# EAGLE design PSU Schematic (EAGLE 8.1.0)
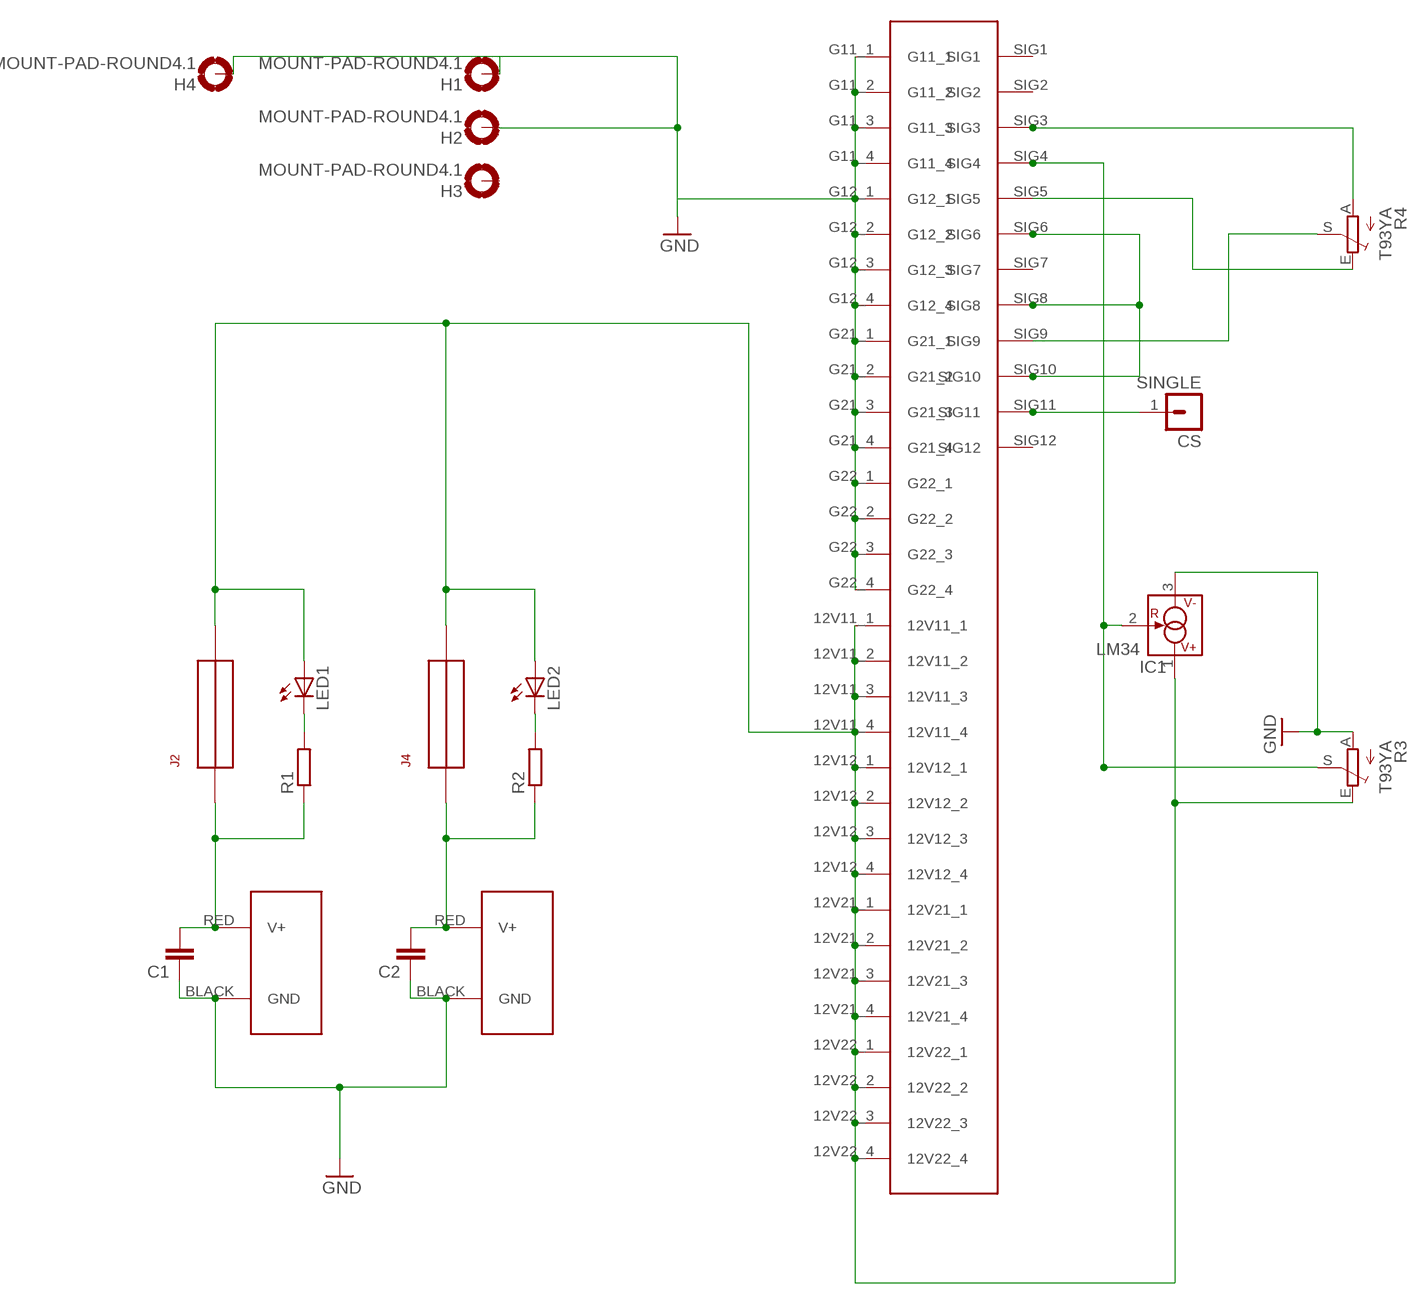
[diagram p0: schematic, sheet 1]

## Parts
C1  C-EU050-025X075  [C050-025X075]
C2  C-EU050-025X075  [C050-025X075]
CS  SINGLE  [SINGLE]
H1  MOUNT-PAD-ROUND4.1  [4,1-PAD]
H2  MOUNT-PAD-ROUND4.1  [4,1-PAD]
H3  MOUNT-PAD-ROUND4.1  [4,1-PAD]
H4  MOUNT-PAD-ROUND4.1  [4,1-PAD]
IC1  LM34  LM334Z  [TO92]
J1  POWERPOLE_POWER45A  [POWERPOLE_PAIR_45A]
J2  FUSEATC  [FUSE_ATC]
J3  POWERPOLE_POWER45A  [POWERPOLE_PAIR_45A]
J4  FUSEATC  [FUSE_ATC]
LED1  LED3MM  [LED3MM]
LED2  LED3MM  [LED3MM]
R1  R-EU_0204/7  [0204/7]
R2  R-EU_0204/7  [0204/7]
R3  T93YA  TRIM_EU-RJ9W  [RJ9W]
R4  T93YA  TRIM_EU-RJ9W  [RJ9W]
U$2  51760-10201202AALF51760-10201202AALF  [51730-073LF]

## Nets
5VCC: R4.A U$2.SIG3
CURRENTSHARE: CS.1 U$2.SIG11
FAN: IC1.2(R) R3.S U$2.SIG4
GND: C1.1 C2.1 H1.B4,1(MOUNT) H2.B4,1(MOUNT) H4.B4,1(MOUNT) IC1.3(V-) J1.BLACK(GND) J3.BLACK(GND) R3.A U$2.G11_1 U$2.G11_2 U$2.G11_3 U$2.G11_4 U$2.G12_1 U$2.G12_2 U$2.G12_3 U$2.G12_4 U$2.G21_1 U$2.G21_2 U$2.G21_3 U$2.G21_4 U$2.G22_1 U$2.G22_2 U$2.G22_3 U$2.G22_4
LVCC: IC1.1(V+) J2.P$3 J2.P$4 J4.P$3 J4.P$4 LED1.A LED2.A R3.E U$2.12V11_1 U$2.12V11_2 U$2.12V11_3 U$2.12V11_4 U$2.12V12_1 U$2.12V12_2 U$2.12V12_3 U$2.12V12_4 U$2.12V21_1 U$2.12V21_2 U$2.12V21_3 U$2.12V21_4 U$2.12V22_1 U$2.12V22_2 U$2.12V22_3 U$2.12V22_4
N$1: R4.E U$2.SIG5
N$2: R4.S U$2.SIG9
N$4: LED1.K(C) R1.2
N$5: LED2.K(C) R2.2
PPV1: C1.2 J1.RED(V+) J2.P$1 J2.P$2 R1.1
PPV2: C2.2 J3.RED(V+) J4.P$1 J4.P$2 R2.1
PSON: U$2.SIG6 U$2.SIG8 U$2.SIG10
Unconnected: H3.B4,1(MOUNT) U$2.SIG1 U$2.SIG2 U$2.SIG7 U$2.SIG12

## Library data of the parts
C1 C2 = resistor:C-EU: CAPACITOR, European symbol
CS = con-lstb:SINGLE
H1-H4 = holes:MOUNT-PAD-ROUND: MOUNTING PAD, round
IC1 = linear:LM*34: 3-Terminal Adjustable Current Sources Source: www.national.com/pf/LM/LM334.html | LM134.pdf
J1 J3 = powerpoles:POWERPOLE_POWER: Anderson Powerpole Power Connector using ameteur radio standard layout
J2 J4 = powerpoles:FUSE
LED1 LED2 = adafruit:LED: LED OSRAM: - CHIPLED LG R971, LG N971, LY N971, LG Q971, LY Q971, LO R971, LY R971 LH N974, LH R974 LS Q976, LO Q976, LY Q976 LO Q996 - Hyper CHIPLED LW Q18S LB Q993, LB Q99A, LB R99A - SideLED LS A670, LO A670, LY A670, LG A670, LP A670 LB A673, LV A673, LT A673, LW A673 LH A674 LY A675 LS A676, LA A676, LO A676, LY A676, LW A676 LS A679, LY A679, LG A679 - Hyper Micro SIDELED® LS Y876, LA Y876, LO Y876, LY Y876 LT Y87S - SmartLED LW L88C, LW L88S LB L89C, LB L89S, LG L890 LS L89K, LO L89K, LY L89K LS L896, LA L896, LO L896, LY L896 - TOPLED LS T670, LO T670, LY T670, LG T670, LP T670 LSG T670, LSP T670, LSY T670, LOP T670, LYG T670 LG T671, LOG T671, LSG T671 LB T673, LV T673, LT T673, LW T673 LH T674 LS T676, LA T676, LO T676, LY T676, LB T676, LH T676, LSB T676, LW T676 LB T67C, LV T67C, LT T67C, LS T67K, LO T67K, LY T67K, LW E67C LS E67B, LA E67B, LO E67B, LY E67B, LB E67C, LV E67C, LT E67C LW T67C LS T679, LY T679, LG T679 LS T770, LO T770, LY T770, LG T770, LP T770 LB T773, LV T773, LT T773, LW T773 LH T774 LS E675, LA E675, LY E675, LS T675 LS T776, LA T776, LO T776, LY T776, LB T776 LHGB T686 LT T68C, LB T68C - Hyper Mini TOPLED® LB M676 - Mini TOPLED Santana® LG M470 LS M47K, LO M47K, LY M47K Source: http://www.osram.convergy.de/
R1 R2 = rcl:R-EU_: RESISTOR, European symbol
R3 R4 = pot:TRIM_EU-: POTENTIOMETER
U$2 = PowerEdge:51760-10201202AALF

## Board
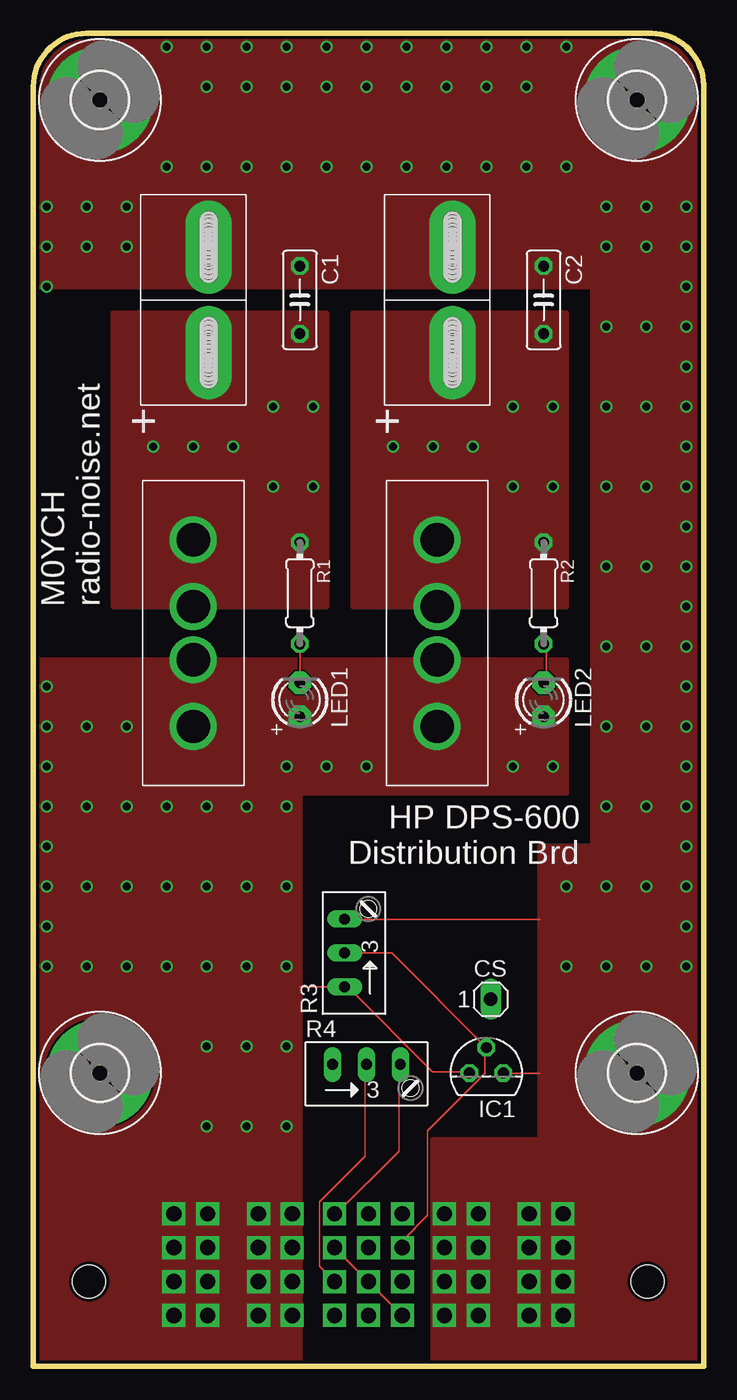
[diagram p1: board, top side]
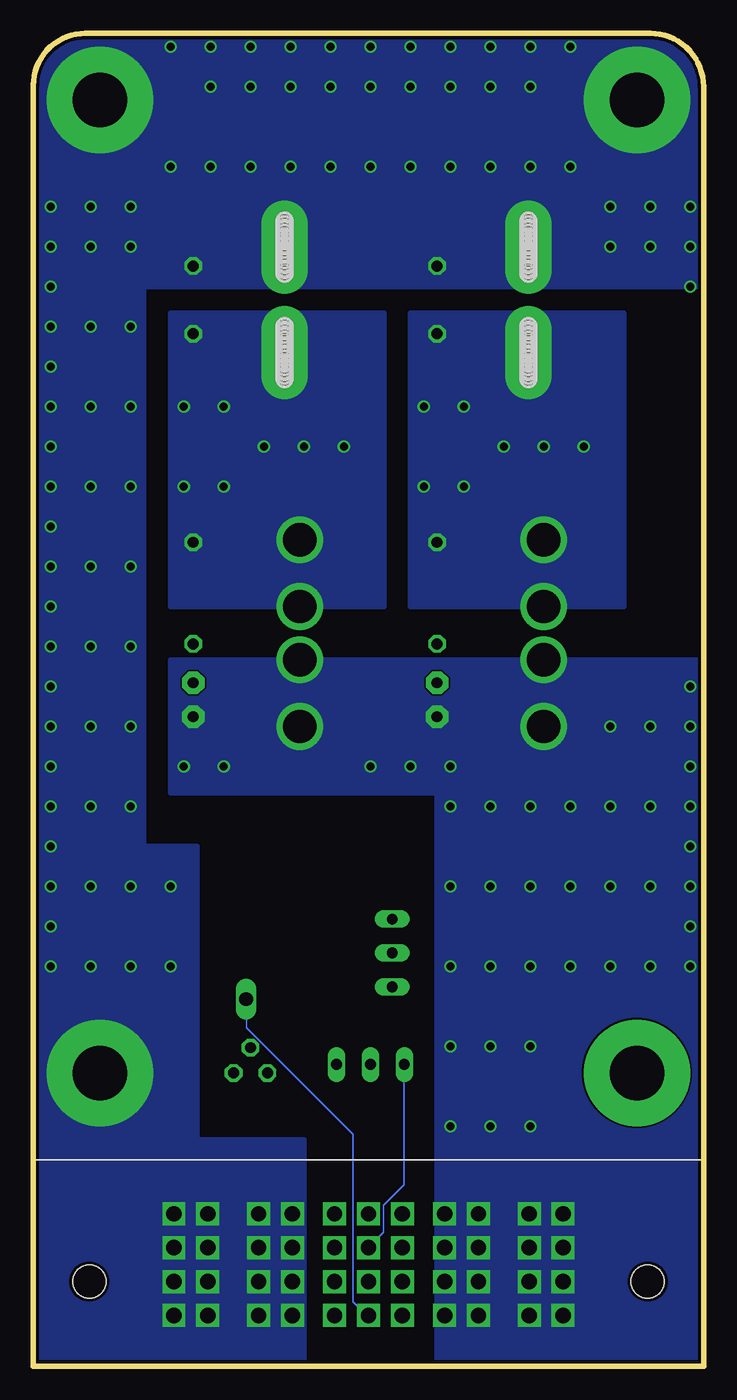
[diagram p2: board, bottom side, seen from below]

Size 50.3 x 100 mm. Coordinates in mm from the lower left corner, seen from the top.
Outline: 50.3,0 50.3,96.09 arc90 46.39,100 4,100 arc90 0,96 0,0 50.3,0
Copper layers (1*16): Top 0.035mm / dielectric 1.5mm / Bottom 0.035mm
Design rules "dirt_cheap_dirty_boards.v1": minimum track width 5mil, minimum drill 12mil, track to track 5mil, track to pad 5mil, pad to pad 5mil, via to via 5mil, smd to smd 0mil, copper to edge 10mil, drill to drill 10mil, minimum pad ring 10mil, minimum via ring 6mil, stop-mask expansion 2mil, vias tented up to drill 25mil, thermal gap 10mil

### Footprints (pad centres in the part's own frame; a part is rotated, then mirrored left to right if it is on the bottom)
C050-025X075 = drill 0.813 octagon: 1 -2.54,0; 2 2.54,0
SINGLE = drill 1.016 long: 1 -2.54,0
4,1-PAD = drill 4.1 pad 8: B4,1 0,0
TO92 = drill 0.813 octagon: 1 -1.27,0; 2 0,1.905; 3 1.27,0
POWERPOLE_PAIR_45A = drill 1.27 pad 3.5 long: BLACK 3.95,-1.15; RED -3.95,-1.15 | hole 1.27: -1.97,-1.15; -5.93,-1.15; 1.97,-1.15; 5.93,-1.15; -4.66,-1.15; -3.39,-1.15; 3.24,-1.15; 4.66,-1.15; -5.676,-1.15; -5.803,-1.15; -5.549,-1.15; -5.422,-1.15; -5.295,-1.15; -5.168,-1.15; -5.041,-1.15; -4.914,-1.15; -4.787,-1.15; -2.097,-1.15; -2.224,-1.15; -2.351,-1.15; -2.478,-1.15; -2.605,-1.15; -2.732,-1.15; -2.986,-1.15; -2.859,-1.15; -3.113,-1.15; -3.24,-1.15; -3.517,-1.15; -3.644,-1.15; -3.771,-1.15; -3.898,-1.15; -4.025,-1.15; -4.152,-1.15; -4.279,-1.15; -4.406,-1.15; -4.533,-1.15; 5.803,-1.15; 5.676,-1.15; 5.549,-1.15; 5.422,-1.15; 5.295,-1.15; 5.168,-1.15; 5.041,-1.15; 4.914,-1.15; 4.787,-1.15; 4.533,-1.15; 4.406,-1.15; 4.279,-1.15; 4.025,-1.15; 4.025,-1.15; 4.152,-1.15; 3.898,-1.15; 3.771,-1.15; 3.771,-1.15; 3.644,-1.15; 3.644,-1.15; 3.644,-1.15; 3.517,-1.15; 3.517,-1.15; 3.39,-1.15; 3.113,-1.15; 2.986,-1.15; 2.859,-1.15; 2.732,-1.15; 2.605,-1.15; 2.478,-1.15; 2.351,-1.15; 2.224,-1.15; 2.097,-1.15
FUSE_ATC = drill 2.5: P$1 -2,0; P$2 -7,0; P$3 2,0; P$4 7,0
LED3MM = drill 0.813 pad 1.676 octagon: A -1.27,0; K 1.27,0
0204/7 = drill 0.813 octagon: 1 -3.81,0; 2 3.81,0
RJ9W = drill 0.813 long: A 2.54,0.635; E -2.54,0.635; S 0,0.635
51730-073LF = drill 1.15 square: 12V11_1 19.43,11.43; 12V11_2 19.43,8.89; 12V11_3 19.43,6.35; 12V11_4 19.43,3.81; 12V12_1 16.89,11.43; 12V12_2 16.89,8.89; 12V12_3 16.89,6.35; 12V12_4 16.89,3.81; 12V21_1 13.08,11.43; 12V21_2 13.08,8.89; 12V21_3 13.08,6.35; 12V21_4 13.08,3.81; 12V22_1 10.54,11.43; 12V22_2 10.54,8.89; 12V22_3 10.54,6.35; 12V22_4 10.54,3.81; G11_1 39.75,11.43; G11_2 39.75,8.89; G11_3 39.75,6.35; G11_4 39.75,3.81; G12_1 37.21,11.43; G12_2 37.21,8.89; G12_3 37.21,6.35; G12_4 37.21,3.81; G21_1 33.4,11.43; G21_2 33.4,8.89; G21_3 33.4,6.35; G21_4 33.4,3.81; G22_1 30.86,11.43; G22_2 30.86,8.89; G22_3 30.86,6.35; G22_4 30.86,3.81; SIG1 27.69,11.43; SIG2 25.15,11.43; SIG3 22.61,11.43; SIG4 27.69,8.89; SIG5 25.15,8.89; SIG6 22.61,8.89; SIG7 27.69,6.35; SIG8 25.15,6.35; SIG9 22.61,6.35; SIG10 27.69,3.81; SIG11 25.15,3.81; SIG12 22.61,3.81 | hole 2.49: 46.1,6.35; 4.19,6.35

### Placement (x,y rotation side)
C1  20,80 270 top
C2  38.3,80 270 top
CS  36.87,27.53 0 top
H1  5,95 0 top
H2  45.3,95 0 top
H3  5,22 0 top
H4  45.3,22 0 top
IC1  34,22 0 top
J1  12,80 90 top
J2  12,55 270 top
J3  30.3,80 90 top
J4  30.3,55 270 top
LED1  20,50 90 top
LED2  38.3,50 90 top
R1  20,58 270 top
R2  38.3,58 270 top
R3  24,31 90 top
R4  25,22 0 top
U$2  0,0 0 top

### Tracks (layer width: path | path; a pad name or v marks a point on that pad's centre or on a via)
5VCC
  Top 0.127: R4.A 27.43,22.61 27.43,16.13 22.73,11.43 U$2.SIG3
CURRENTSHARE
  Bottom 0.127: CS.1 34.29,27.43 34.29,25.4 26.29,17.4 26.29,4.83 25.27,3.81 U$2.SIG11
FAN
  Top 0.127: R3.S 23.37,30.99 26.92,30.99 33.91,24 IC1.2 33.91,23.88 33.91,21.97 29.59,17.65 29.59,11.3 27.81,9.53 27.81,8.89 U$2.SIG4
GND  (via drill 0.6)
  Top 0.127: 38,21.97 35.31,21.97 IC1.3 | 38,33.53 23.37,33.53 R3.A
  other vias: 13,96 16,96 19,96 22,96 25,96 28,96 31,96 34,96 37,96 10,90 13,90 16,90 19,90 22,90 25,90 28,90 31,90 34,90 37,90 40,90 49,84 46,84 43,84 43,78 46,78 49,78 49,72 46,72 43,72 43,66 46,66 49,66 49,60 46,60 43,60 43,54 46,54 49,54 49,30 46,30 43,30 46,36 49,36 43,36 43,42 46,42 49,42 49,48 46,48 43,48 49,33 49,39 49,45 49,51 49,63 49,57 49,69 49,75 49,81 49,87 40,99 37,99 34,99 31,99 28,99 25,99 22,99 19,99 16,99 13,99 10,99 1,87 1,84 4,84 4,87 7,84 7,87 1,81 46,87 43,87 40,36 40,30
  pour Bottom (no thermals): 30,-3 61,-3 61,109 -16,109 -18,107 -18,81 42,81 42,17 30,17
  pour Top (no thermals): 30,-3 61,-3 61,109 -16,109 -18,107 -18,81 42,81 42,17 30,17
  pour Bottom (no thermals): 43,39 38,39 38,16 45,16 45,32
  pour Top (no thermals): 45,39 38,39 38,16 45,16
LVCC  (via drill 0.6)
  Top 0.127: IC1.1 32.64,22.1 29.97,22.1 23.62,28.45 23.37,28.45 R3.E 23.24,28.45 20,28.45
  other vias: 1,30 4,30 7,30 10,30 13,30 16,30 19,30 13,24 16,24 19,24 13,18 16,18 19,18 1,36 4,36 7,36 10,36 13,36 16,36 19,36 1,42 4,42 7,42 10,42 13,42 16,42 19,42 1,48 4,48 7,48 1,33 1,39 1,45 1,51 19,45 22,45 25,45 36,45 39,45
  pour Bottom (no thermals): 20,-2 -2,-2 -2,53 40,53 40,43 20,43
  pour Top (no thermals): 20,-2 -2,-2 -2,53 40,53 40,43 20,43
N$1
  Bottom 0.127: R4.E 22.48,22.61 22.48,13.59 24,12.06 24,10.03 U$2.SIG5
N$2
  Top 0.127: R4.S 24.89,22.61 24.89,15.75 21.46,12.32 21.46,7.49 U$2.SIG9
N$4
  Top 0.127: LED1.K R1.2
N$5
  Top 0.127: R2.2 38.5,54 38.5,51.5 LED2.K
PPV1  (via drill 0.6)
  other vias: 15,69 12,69 9,69 18,72 21,72 21,66 18,66
  pour Bottom (no thermals): 6,57 22,57 22,79 6,79
  pour Top (no thermals): 22,79 6,79 6,57 22,57
PPV2  (via drill 0.6)
  other vias: 33,69 30,69 27,69 36,66 39,66 39,72 36,72
  pour Bottom (no thermals): 24,57 40,57 40,79 24,79
  pour Top (no thermals): 24,57 40,57 40,79 24,79
PSON
  Top 0.127: U$2.SIG8 U$2.SIG6 | U$2.SIG8 U$2.SIG10 | U$2.SIG8

### Text on the board
tNames: M0YCH / radio-noise.net | HP DPS-600 / Distribution Brd